# EAGLE schematic GMC-4 UBW Loader (EAGLE 6.2)
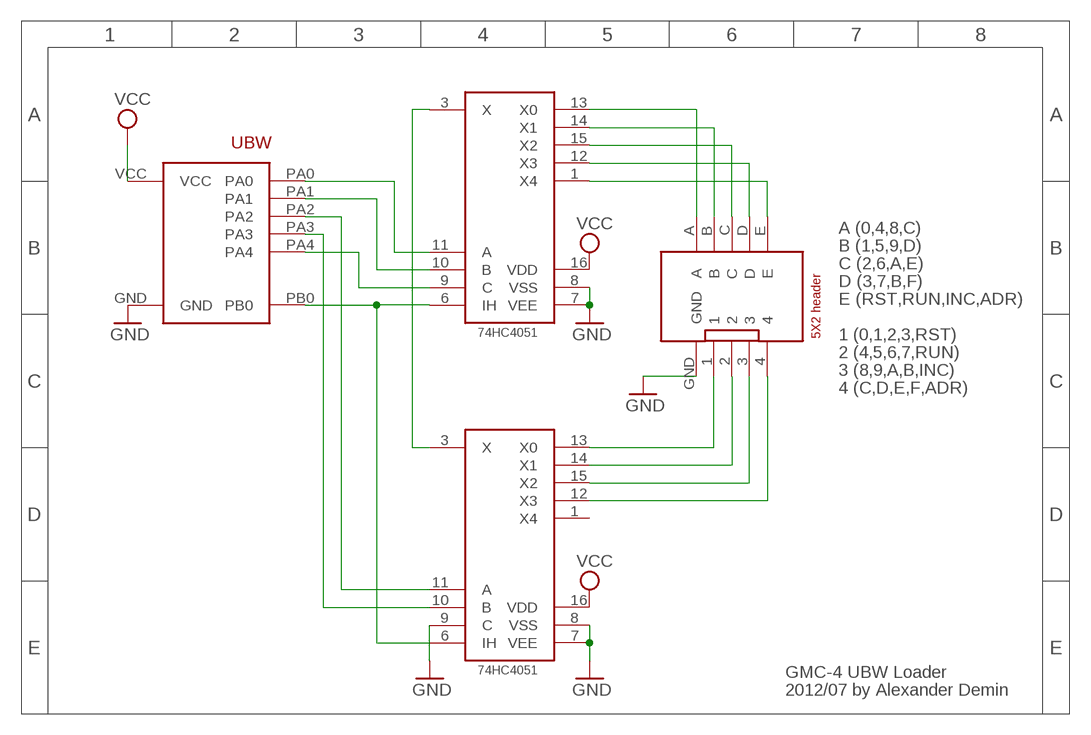
[diagram p0: schematic, sheet 1]

## Parts
U$1  UBW  [UBW]
U$2  5X2  [5X2]
U$3  4051  [4051]
U$4  4051  [4051]

## Nets
GND: U$1.GND U$2.GND U$3.7(VEE) U$3.8(VSS) U$4.7(VEE) U$4.8(VSS) U$4.9(C)
N$1: U$1.PB0 U$3.6(IH) U$4.6(IH)
N$2: U$1.PA0 U$3.11(A)
N$3: U$3.3(X) U$4.3(X)
N$4: U$1.PA1 U$3.10(B)
N$5: U$1.PA4 U$3.9(C)
N$6: U$1.PA2 U$4.11(A)
N$7: U$1.PA3 U$4.10(B)
N$8: U$2.A U$3.13(X0)
N$9: U$2.B U$3.14(X1)
N$10: U$2.C U$3.15(X2)
N$11: U$2.D U$3.12(X3)
N$12: U$2.E U$3.1(X4)
N$13: U$2.1 U$4.13(X0)
N$14: U$2.2 U$4.14(X1)
N$15: U$2.3 U$4.15(X2)
N$16: U$2.4 U$4.12(X3)
VCC: U$1.VCC U$3.16(VDD) U$4.16(VDD)
Unconnected: U$4.1(X4)

## Notes on the sheet
- A (0,4,8,C)
- B (1,5,9,D)
- C (2,6,A,E)
- D (3,7,B,F)
- E (RST,RUN,INC,ADR)
- 1 (0,1,2,3,RST)
- 2 (4,5,6,7,RUN)
- 3 (8,9,A,B,INC)
- 4 (C,D,E,F,ADR)
- GMC-4 UBW Loader
- 2012/07 by Alexander Demin

## Library data of the parts
U$1 = UBW:UBW
U$2 = UBW:5X2
U$3 U$4 = UBW:4051